# EAGLE design DMUX (EAGLE 6.5.0)
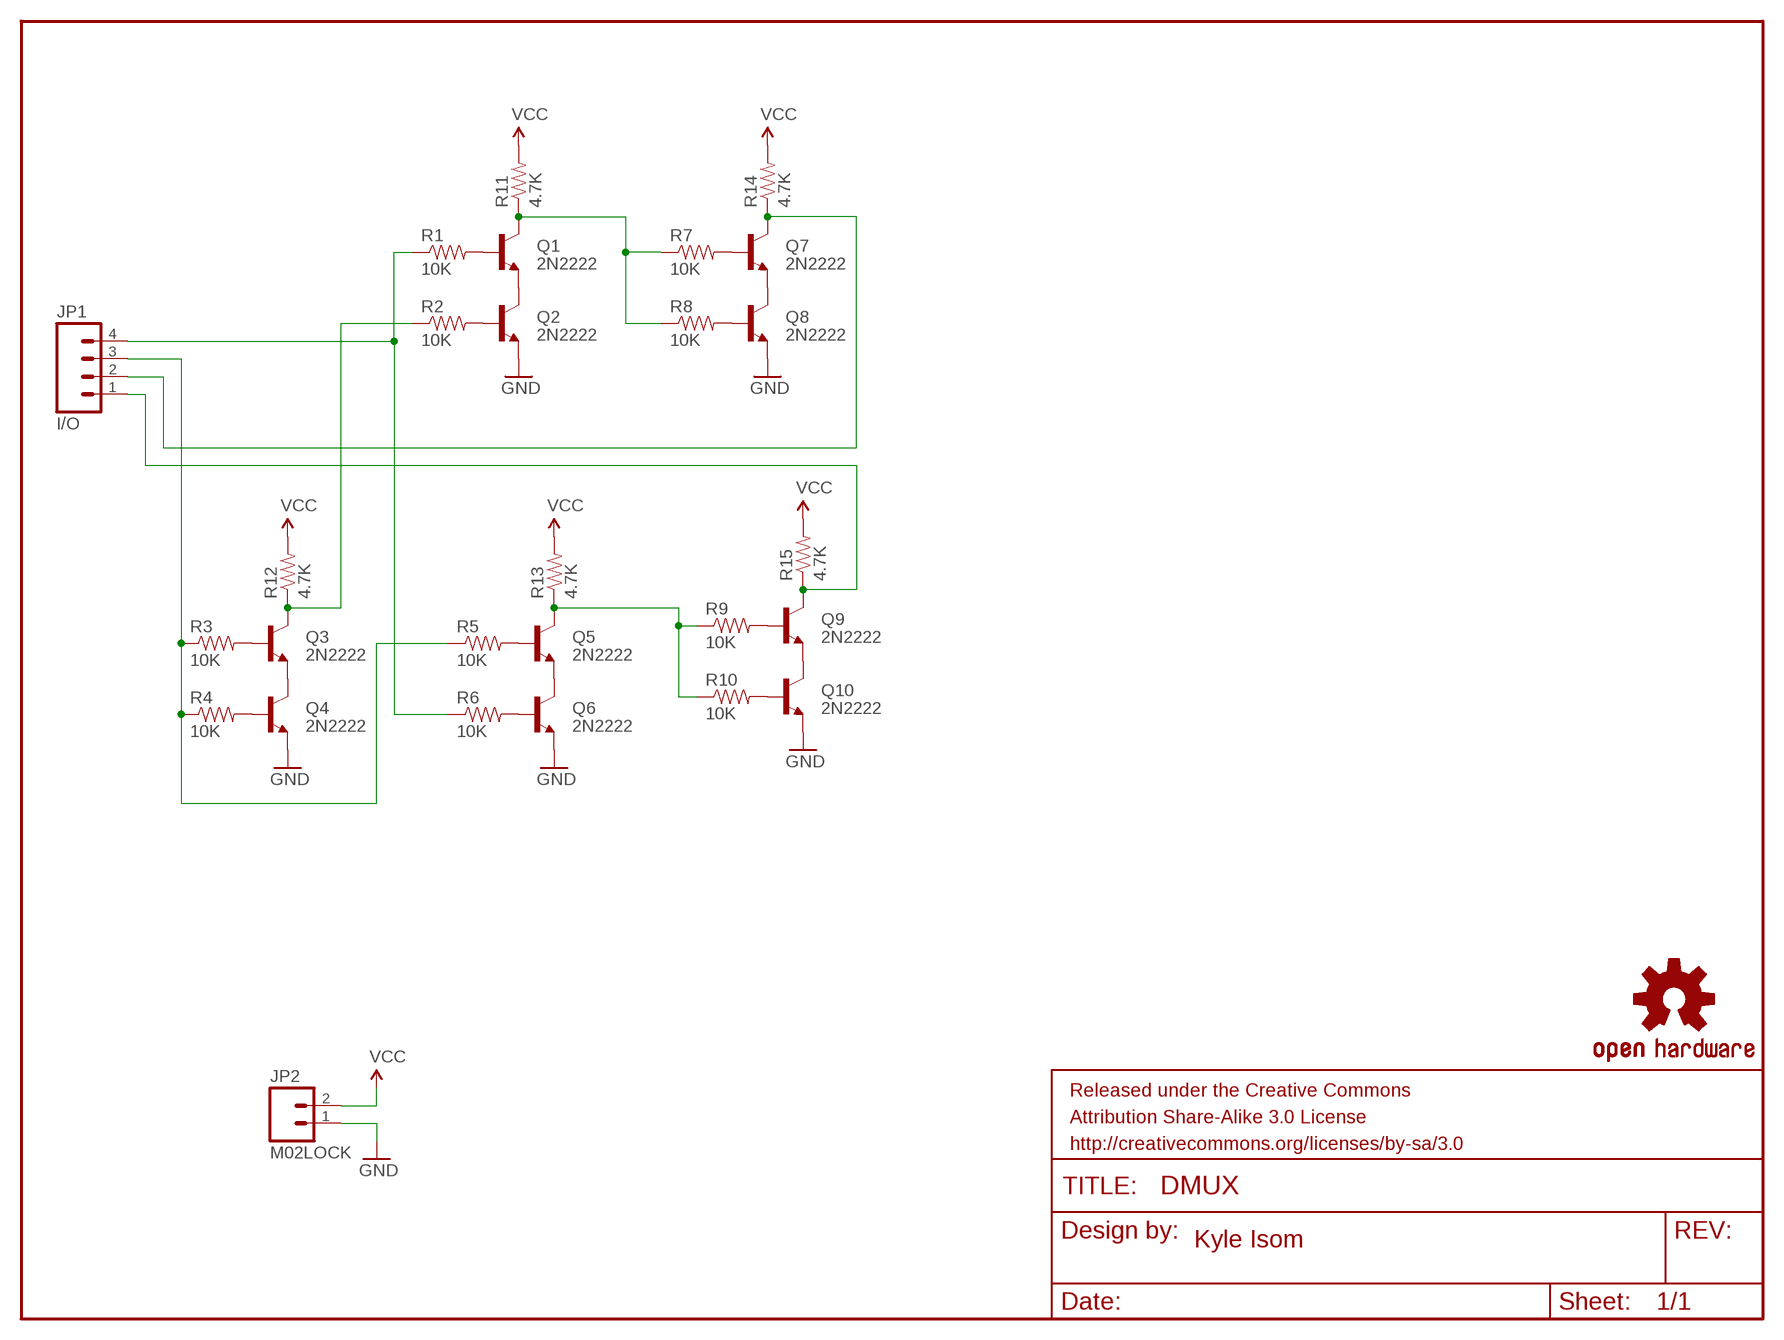
[diagram p0: schematic, sheet 1]

## Parts
FRAME1  FRAME-LETTER  [CREATIVE_COMMONS]
JP1  I/O  M04LOCK  [1X04_LOCK]
JP2  M02LOCK  [1X02_LOCK]
LOGO1  OSHW-LOGOS  [OSHW-LOGO-S]
Q1  2N2222  TRANSISTOR_NPNTO-92-AMMO  [TO-92-AMMO]
Q2  2N2222  TRANSISTOR_NPNTO-92-AMMO  [TO-92-AMMO]
Q3  2N2222  TRANSISTOR_NPNTO-92-AMMO  [TO-92-AMMO]
Q4  2N2222  TRANSISTOR_NPNTO-92-AMMO  [TO-92-AMMO]
Q5  2N2222  TRANSISTOR_NPNTO-92-AMMO  [TO-92-AMMO]
Q6  2N2222  TRANSISTOR_NPNTO-92-AMMO  [TO-92-AMMO]
Q7  2N2222  TRANSISTOR_NPNTO-92-AMMO  [TO-92-AMMO]
Q8  2N2222  TRANSISTOR_NPNTO-92-AMMO  [TO-92-AMMO]
Q9  2N2222  TRANSISTOR_NPNTO-92-AMMO  [TO-92-AMMO]
Q10  2N2222  TRANSISTOR_NPNTO-92-AMMO  [TO-92-AMMO]
R1  10K  RESISTORPTH-1/4W  [AXIAL-0.4]
R2  10K  RESISTORPTH-1/4W  [AXIAL-0.4]
R3  10K  RESISTORPTH-1/4W  [AXIAL-0.4]
R4  10K  RESISTORPTH-1/4W  [AXIAL-0.4]
R5  10K  RESISTORPTH-1/4W  [AXIAL-0.4]
R6  10K  RESISTORPTH-1/4W  [AXIAL-0.4]
R7  10K  RESISTORPTH-1/4W  [AXIAL-0.4]
R8  10K  RESISTORPTH-1/4W  [AXIAL-0.4]
R9  10K  RESISTORPTH-1/4W  [AXIAL-0.4]
R10  10K  RESISTORPTH-1/4W  [AXIAL-0.4]
R11  4.7K  RESISTORPTH-1/4W  [AXIAL-0.4]
R12  4.7K  RESISTORPTH-1/4W  [AXIAL-0.4]
R13  4.7K  RESISTORPTH-1/4W  [AXIAL-0.4]
R14  4.7K  RESISTORPTH-1/4W  [AXIAL-0.4]
R15  4.7K  RESISTORPTH-1/4W  [AXIAL-0.4]

## Nets
GND: JP2.1 Q2.1(E) Q4.1(E) Q6.1(E) Q8.1(E) Q10.1(E)
N$1: Q1.1(E) Q2.3(C)
N$2: Q3.1(E) Q4.3(C)
N$3: Q5.1(E) Q6.3(C)
N$4: Q7.1(E) Q8.3(C)
N$5: Q9.1(E) Q10.3(C)
N$6: Q1.2(B) R1.P$2
N$7: Q2.2(B) R2.P$2
N$8: Q3.2(B) R3.P$2
N$9: Q4.2(B) R4.P$2
N$10: Q5.2(B) R5.P$2
N$11: Q6.2(B) R6.P$2
N$12: Q8.2(B) R8.P$2
N$13: Q9.2(B) R9.P$2
N$14: Q10.2(B) R10.P$2
N$15: Q7.2(B) R7.P$2
N$16: Q1.3(C) R7.P$1 R8.P$1 R11.P$1
N$17: Q3.3(C) R2.P$1 R12.P$1
N$18: JP1.2 Q7.3(C) R14.P$1
N$19: JP1.1 Q9.3(C) R15.P$1
N$20: JP1.4 R1.P$1 R6.P$1
N$21: Q5.3(C) R9.P$1 R10.P$1 R13.P$1
N$22: JP1.3 R3.P$1 R4.P$1 R5.P$1
VCC: JP2.2 R11.P$2 R12.P$2 R13.P$2 R14.P$2 R15.P$2

## Notes on the sheet
- Kyle Isom

## Library data of the parts
FRAME1 = SparkFun-Aesthetics:FRAME-LETTER: Schematic Frame Standard 8.5x11 US Letter frame
JP1 = SparkFun-Connectors:M04: Header 4 Standard 4-pin 0.1" header. Use with straight break away headers (SKU : PRT-00116), right angle break away headers (PRT-00553), swiss pins (PRT-00743), machine pins (PRT-00117), and female headers (PRT-00115). Molex polarized connector foot print use with SKU : PRT-08231 with associated crimp pins and housings. 1MM SMD Version SKU: PRT-10208
JP2 = SparkFun-Connectors:M02: Standard 2-pin 0.1" header. Use with - straight break away headers ( PRT-00116) - right angle break away headers (PRT-00553) - swiss pins (PRT-00743) - machine pins (PRT-00117) - female headers (PRT-00115) Molex polarized connector foot print use with: PRT-08233 with associated crimp pins and housings. 2.54_SCREWTERM for use with PRT-10571. 3.5mm Screw Terminal footprints for PRT-08084 5mm Screw Terminal footprints for use with PRT-08433
LOGO1 = SparkFun-Aesthetics:OSHW-LOGO: Open Source Hardware Logo This logo indicates the piece of hardware it is found on incorporates a OSHW license and/or adheres to the definition of open source hardware found here: http://freedomdefined.org/OSHW
Q1-Q10 = SparkFun-DiscreteSemi:TRANSISTOR_NPN: Generic NPN BJT MMBT2222A - TRANS-08049 (SOT-23, 1A 40V) MPSA42 - TRANS-09116 (SOT-23, 500mA 300V) MMBT5088LT1G - TRANS-11160 (SOT-23, 50 mA 30V)
R1-R15 = SparkFun-Passives:RESISTOR: Resistor Basic schematic elements and footprints for 0603, 1206, and PTH resistors.

## Board
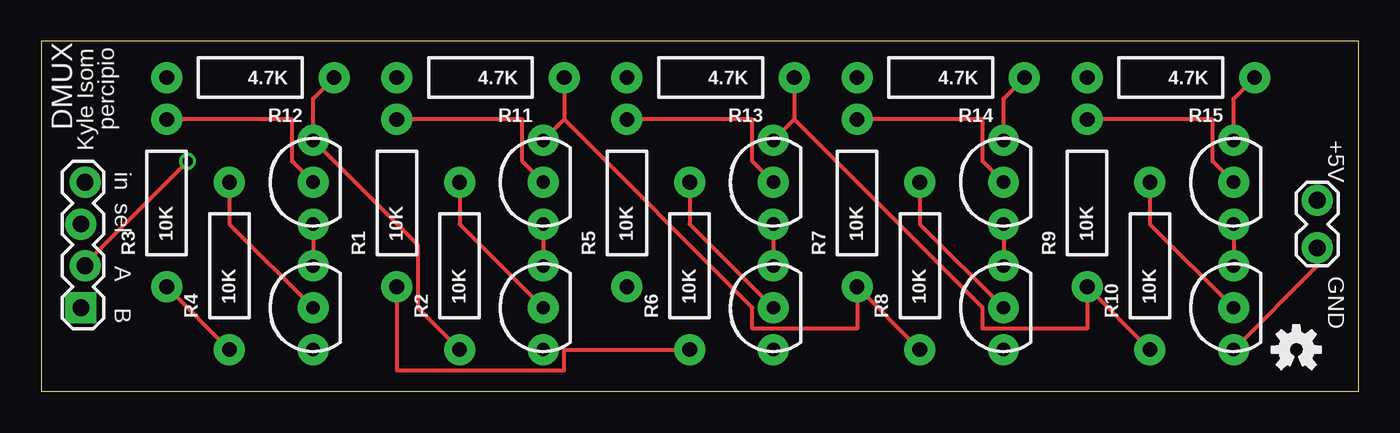
[diagram p1: board, top side]
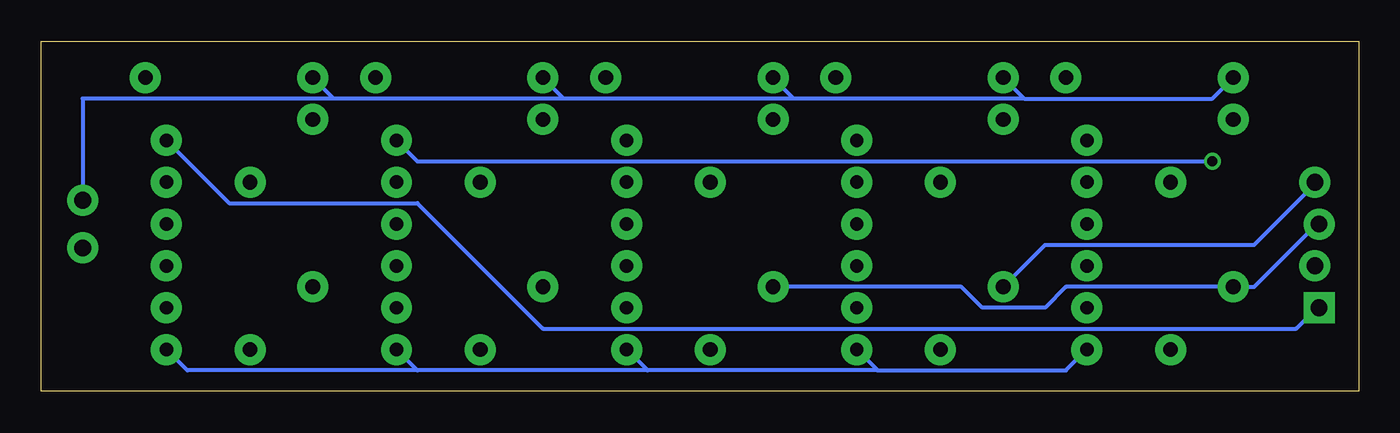
[diagram p2: board, bottom side, seen from below]

Size 79.99 x 21.26 mm. Coordinates in mm from the lower left corner, seen from the top.
Outline: 0,0 79.99,0 79.99,21.26 0,21.26 0,0
Copper layers (1*16): Top 0.035mm / dielectric 1.5mm / Bottom 0.035mm
Design rules "default": minimum track width 10mil, minimum drill 24mil, track to track 8mil, track to pad 8mil, pad to pad 8mil, via to via 8mil, smd to smd 8mil, copper to edge 40mil, drill to drill 8mil, minimum pad ring 10mil, minimum via ring 8mil, stop-mask expansion 4mil, vias tented up to drill 0mil, thermal gap 10mil

### Footprints (pad centres in the part's own frame; a part is rotated, then mirrored left to right if it is on the bottom)
1X04_LOCK = drill 1.016 pad 1.88 square: 1 0,0.127 | drill 1.016 pad 1.88: 2 2.54,-0.127; 3 5.08,0.127; 4 7.62,-0.127
1X02_LOCK = drill 1.016 pad 1.88: 1 -0.178,0; 2 2.718,0
TO-92-AMMO = drill 0.813 pad 1.88: 1 -2.54,0; 2 0,0; 3 2.54,0
AXIAL-0.4 = drill 0.9 pad 1.88: P$1 -5.08,0; P$2 5.08,0

### Placement (x,y rotation side)
FRAME1  19.05,-8.89 0 top  (outside the outline)
JP1  2.54,5.08 90 top
JP2  77.47,8.89 90 top
LOGO1  76.2,2.54 0 top
Q1  30.48,12.7 90 top
Q2  30.48,5.08 90 top
Q3  16.51,12.7 90 top
Q4  16.51,5.08 90 top
Q5  44.45,12.7 90 top
Q6  44.45,5.08 90 top
Q7  58.42,12.7 90 top
Q8  58.42,5.08 90 top
Q9  72.39,12.7 90 top
Q10  72.39,5.08 90 top
R1  21.59,11.43 90 top
R2  25.4,7.62 90 top
R3  7.62,11.43 90 top
R4  11.43,7.62 90 top
R5  35.56,11.43 90 top
R6  39.37,7.62 90 top
R7  49.53,11.43 90 top
R8  53.34,7.62 90 top
R9  63.5,11.43 90 top
R10  67.31,7.62 90 top
R11  26.67,19.05 180 top
R12  12.7,19.05 180 top
R13  40.64,19.05 180 top
R14  54.61,19.05 180 top
R15  68.58,19.05 180 top

### Tracks (layer width: path | path; a pad name or v marks a point on that pad's centre or on a via)
GND
  Top 0.254: Q10.1 77.47,7.62 JP2.1 77.47,8.89
  Bottom 0.254: Q4.1 17.78,1.27 29.21,1.27 | Q2.1 29.21,1.27 | 43.18,1.27 Q6.1 | 29.21,1.27 43.18,1.27 | 57.15,1.27 Q8.1 | 43.18,1.27 57.15,1.27 | Q10.1 71.12,1.27 57.15,1.27
N$1
  Top 0.254: Q1.1 Q2.3
N$2
  Top 0.254: Q3.1 Q4.3
N$3
  Top 0.254: Q5.1 Q6.3
N$4
  Top 0.254: Q7.1 Q8.3
N$5
  Top 0.254: Q9.1 Q10.3
N$6
  Top 0.254: R1.P$2 29.21,16.51 29.21,13.97 Q1.2
N$7
  Top 0.254: Q2.2 25.4,10.16 R2.P$2
N$8
  Top 0.254: R3.P$2 15.24,16.51 15.24,13.97 Q3.2
N$9
  Top 0.254: Q4.2 11.43,10.16 R4.P$2
N$10
  Top 0.254: R5.P$2 43.18,16.51 43.18,13.97 Q5.2
N$11
  Top 0.254: Q6.2 39.37,10.16 R6.P$2
N$12
  Top 0.254: Q8.2 53.34,10.16 R8.P$2
N$13
  Top 0.254: R9.P$2 71.12,16.51 71.12,13.97 Q9.2
N$14
  Top 0.254: Q10.2 67.31,10.16 R10.P$2
N$15
  Top 0.254: R7.P$2 57.15,16.51 57.15,13.97 Q7.2
N$16
  Top 0.254: 31.75,16.51 Q1.3 | R11.P$1 31.75,16.51 | R8.P$1 R7.P$1 49.53,3.81 43.18,3.81 43.18,5.08 31.75,16.51
N$17
  Top 0.254: R2.P$1 22.86,5.08 22.86,8.89 Q3.3 16.51,17.78 R12.P$1
N$18  (via drill 0.61)
  Top 0.254: v8.89,13.97 2.54,7.62 JP1.2 | R14.P$1 58.42,17.78 Q7.3
  Bottom 0.254: v8.89,13.97 57.15,13.97 Q7.3
N$19
  Top 0.254: R15.P$1 72.39,17.78 Q9.3
  Bottom 0.254: Q9.3 68.58,11.43 57.15,11.43 49.53,3.81 3.81,3.81 2.54,5.08 JP1.1
N$20
  Top 0.254: R6.P$1 31.75,2.54 31.75,1.27 21.59,1.27 R1.P$1
  Bottom 0.254: R1.P$1 19.05,8.89 6.35,8.89 2.54,12.7 JP1.4
N$21
  Top 0.254: 45.72,16.51 Q5.3 | R13.P$1 45.72,16.51 | R10.P$1 R9.P$1 63.5,3.81 57.15,3.81 57.15,5.08 45.72,16.51
N$22
  Top 0.254: R3.P$1 R4.P$1
  Bottom 0.254: R5.P$1 24.13,6.35 22.86,5.08 19.05,5.08 17.78,6.35 R3.P$1 6.35,6.35 2.54,10.16 JP1.3
VCC
  Bottom 0.254: R12.P$2 8.89,17.78 20.32,17.78 | R11.P$2 20.32,17.78 | 34.29,17.78 R13.P$2 | 20.32,17.78 34.29,17.78 | 48.26,17.78 R14.P$2 | 34.29,17.78 48.26,17.78 | 62.23,17.78 R15.P$2 | 48.26,17.78 62.23,17.78 | 62.23,17.78 77.47,17.78 JP2.2 77.47,11.43

### Text on the board
tPlace: DMUX | percipio | Kyle Isom | +5V | in | sel | A | GND | B